# EAGLE design PortalsDualExpVCA (EAGLE 9.6.2)
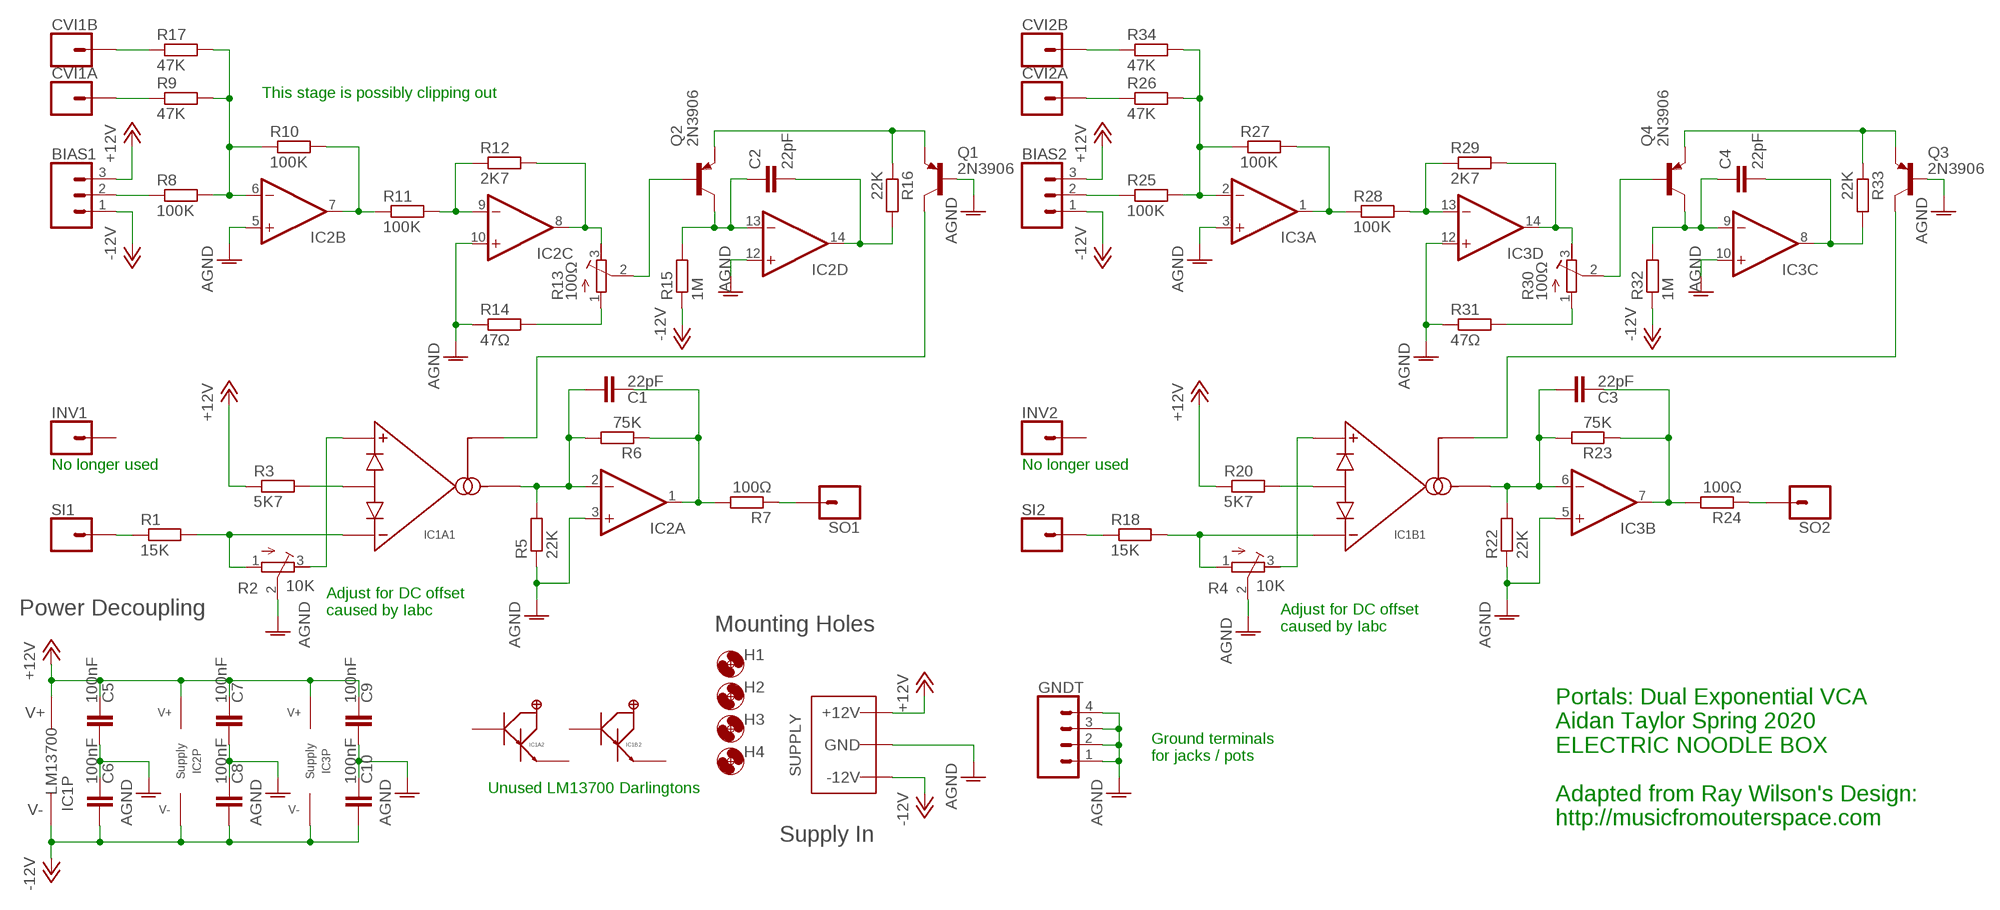
[diagram p0: schematic, sheet 1]

## Parts
BIAS1  3XWIREPAD  [1X03]
BIAS2  3XWIREPAD  [1X03]
C1  22pF  C-EU050-025X075  [C050-025X075]
C2  22pF  C-EU050-025X075  [C050-025X075]
C3  22pF  C-EU050-025X075  [C050-025X075]
C4  22pF  C-EU050-025X075  [C050-025X075]
C5  100nF  C-EU050-025X075  [C050-025X075]
C6  100nF  C-EU050-025X075  [C050-025X075]
C7  100nF  C-EU050-025X075  [C050-025X075]
C8  100nF  C-EU050-025X075  [C050-025X075]
C9  100nF  C-EU050-025X075  [C050-025X075]
C10  100nF  C-EU050-025X075  [C050-025X075]
CVI1A  1XWIREPAD  [1X01]
CVI1B  1XWIREPAD  [1X01]
CVI2A  1XWIREPAD  [1X01]
CVI2B  1XWIREPAD  [1X01]
GNDT  4XWIREPAD  [1X04]
H1  MOUNT-HOLE3.2  [3,2]
H2  MOUNT-HOLE3.2  [3,2]
H3  MOUNT-HOLE3.2  [3,2]
H4  MOUNT-HOLE3.2  [3,2]
IC1  LM13700DIL  [DIL16]
IC2  TL0X4DIL  [DIL14]
IC3  TL0X4DIL  [DIL14]
INV1  1XWIREPAD  [1X01]
INV2  1XWIREPAD  [1X01]
Q1  2N3906  [TO92]
Q2  2N3906  [TO92]
Q3  2N3906  [TO92]
Q4  2N3906  [TO92]
R1  15K  R-EU_0207/10  [0207/10]
R2  10K  R-TRIMM3296W  [RTRIM3296W]
R3  5K7  R-EU_0207/10  [0207/10]
R4  10K  R-TRIMM3296W  [RTRIM3296W]
R5  22K  R-EU_0207/10  [0207/10]
R6  75K  R-EU_0207/10  [0207/10]
R7  100Ω  R-EU_0207/10  [0207/10]
R8  100K  R-EU_0207/10  [0207/10]
R9  47K  R-EU_0207/10  [0207/10]
R10  100K  R-EU_0207/10  [0207/10]
R11  100K  R-EU_0207/10  [0207/10]
R12  2K7  R-EU_0207/10  [0207/10]
R13  100Ω  R-TRIMM3296W  [RTRIM3296W]
R14  47Ω  R-EU_0207/10  [0207/10]
R15  1M  R-EU_0207/10  [0207/10]
R16  22K  R-EU_0207/10  [0207/10]
R17  47K  R-EU_0207/10  [0207/10]
R18  15K  R-EU_0207/10  [0207/10]
R20  5K7  R-EU_0207/10  [0207/10]
R22  22K  R-EU_0207/10  [0207/10]
R23  75K  R-EU_0207/10  [0207/10]
R24  100Ω  R-EU_0207/10  [0207/10]
R25  100K  R-EU_0207/10  [0207/10]
R26  47K  R-EU_0207/10  [0207/10]
R27  100K  R-EU_0207/10  [0207/10]
R28  100K  R-EU_0207/10  [0207/10]
R29  2K7  R-EU_0207/10  [0207/10]
R30  100Ω  R-TRIMM3296W  [RTRIM3296W]
R31  47Ω  R-EU_0207/10  [0207/10]
R32  1M  R-EU_0207/10  [0207/10]
R33  22K  R-EU_0207/10  [0207/10]
R34  47K  R-EU_0207/10  [0207/10]
SI1  1XWIREPAD  [1X01]
SI2  1XWIREPAD  [1X01]
SO1  1XWIREPAD  [1X01]
SO2  1XWIREPAD  [1X01]
WP1  COMBO_SUPPLY_HEADER  [COMBINED_POWER]

## Nets
+12V: BIAS1.3 BIAS2.3 C5.2 C7.2 C9.2 IC1.11(P:V+) IC2.4(P:V+) IC3.4(P:V+) R3.1 R20.1 WP1.V+1(V++) WP1.V+2(V++) WP1.V+3(V++)
-12V: BIAS1.1 BIAS2.1 C6.1 C8.1 C10.1 IC1.6(P:V-) IC2.11(P:V-) IC3.11(P:V-) R15.1 R32.1 WP1.V-1(V--) WP1.V-2(V--) WP1.V-3(V--)
AGND: C5.1 C6.2 C7.1 C8.2 C9.1 C10.2 GNDT.1 GNDT.2 GNDT.3 GNDT.4 IC2.3(A:+IN) IC2.5(B:+IN) IC2.10(C:+IN) IC2.12(D:+IN) IC3.3(A:+IN) IC3.5(B:+IN) IC3.10(C:+IN) IC3.12(D:+IN) Q1.2(B) Q3.2(B) R2.2(S) R4.2(S) R5.1 R14.1 R22.1 R31.1 WP1.GND1(AGND) WP1.GND2(AGND) WP1.GND3(AGND) WP1.GND4(AGND) WP1.GND5(AGND) WP1.GND6(AGND) WP1.GND7(AGND) WP1.GND8(AGND)
N$1: R1.1 SI1.1
N$2: IC1.3(A1:AMP+) R2.3(E)
N$3: BIAS1.2 R8.1
N$4: IC1.4(A1:AMP-) R1.2 R2.1(A)
N$5: IC1.2(A1:DIODES) R3.2
N$6: R7.1 SO1.1
N$7: C1.1 IC1.5(A1:AMPOUT) IC2.2(A:-IN) R5.2 R6.2
N$8: C1.2 IC2.1(A:OUT) R6.1 R7.2
N$9: CVI1A.1 R9.1
N$10: IC2.6(B:-IN) R8.2 R9.2 R10.1 R17.2
N$11: IC2.7(B:OUT) R10.2 R11.1
N$12: IC2.9(C:-IN) R11.2 R12.1
N$13: IC2.8(C:OUT) R12.2 R13.3(E)
N$14: R13.1(A) R14.2
N$15: Q2.2(B) R13.2(S)
N$16: C2.1 IC2.13(D:-IN) Q2.1(C) R15.2
N$17: Q1.3(E) Q2.3(E) R16.1
N$18: C2.2 IC2.14(D:OUT) R16.2
N$19: CVI1B.1 R17.1
N$20: IC1.1(A1:AMPBIAS) Q1.1(C)
N$21: R18.1 SI2.1
N$22: IC1.14(B1:AMP+) R4.3(E)
N$23: IC1.13(B1:AMP-) R4.1(A) R18.2
N$24: IC1.15(B1:DIODES) R20.2
N$25: C3.1 IC1.12(B1:AMPOUT) IC3.6(B:-IN) R22.2 R23.2
N$26: C3.2 IC3.7(B:OUT) R23.1 R24.2
N$27: R24.1 SO2.1
N$28: BIAS2.2 R25.1
N$29: CVI2A.1 R26.1
N$30: IC3.2(A:-IN) R25.2 R26.2 R27.1 R34.2
N$31: IC3.1(A:OUT) R27.2 R28.1
N$32: IC3.13(D:-IN) R28.2 R29.1
N$33: IC3.14(D:OUT) R29.2 R30.3(E)
N$34: R30.1(A) R31.2
N$35: C4.1 IC3.9(C:-IN) Q4.1(C) R32.2
N$36: C4.2 IC3.8(C:OUT) R33.2
N$37: Q3.3(E) Q4.3(E) R33.1
N$38: IC1.16(B1:AMPBIAS) Q3.1(C)
N$39: Q4.2(B) R30.2(S)
N$40: CVI2B.1 R34.1
Unconnected: IC1.7(A2:BUFF_IN) IC1.8(A2:BUFF_OUT) IC1.9(B2:BUFF_OUT) IC1.10(B2:BUFF_IN) INV1.1 INV2.1

## Notes on the sheet
- This stage is possibly clipping out
- No longer used | No longer used
- Power Decoupling
- Adjust for DC offset
  caused by Iabc
- Mounting Holes
- Adjust for DC offset
  caused by Iabc
- Ground terminals
  for jacks / pots
- Unused LM13700 Darlingtons
- Portals: Dual Exponential VCA
  Aidan Taylor Spring 2020
  ELECTRIC NOODLE BOX
  
  Adapted from Ray Wilson's Design:
  http://musicfromouterspace.com
- Supply In

## Library data of the parts
BIAS1 BIAS2 = ElectricNoodleBox:3XWIREPAD
C1-C10 = rcl:C-EU: CAPACITOR, European symbol; SPICEPREFIX: C
CVI1A CVI1B CVI2A CVI2B INV1 INV2 SI1 SI2 SO1 SO2 = ElectricNoodleBox:1XWIREPAD
GNDT = ElectricNoodleBox:4XWIREPAD
H1-H4 = holes:MOUNT-HOLE: MOUNTING HOLE with drill center marker
IC1 = ElectricNoodleBox:LM13700
IC2 IC3 = ElectricNoodleBox:TL0X4
Q1-Q4 = transistor-pnp:2N3906: PNP Transistor
R1 R3 R5-R12 R14-R18 R20 R22-R29 R31-R34 = rcl:R-EU_: RESISTOR, European symbol; SPICEPREFIX: R
R2 R4 R13 R30 = rcl:R-TRIMM: Trimm resistor; SPICEMODEL: X; SPICEPREFIXL: POT
WP1 = ElectricNoodleBox:COMBO_SUPPLY_HEADER

## Board
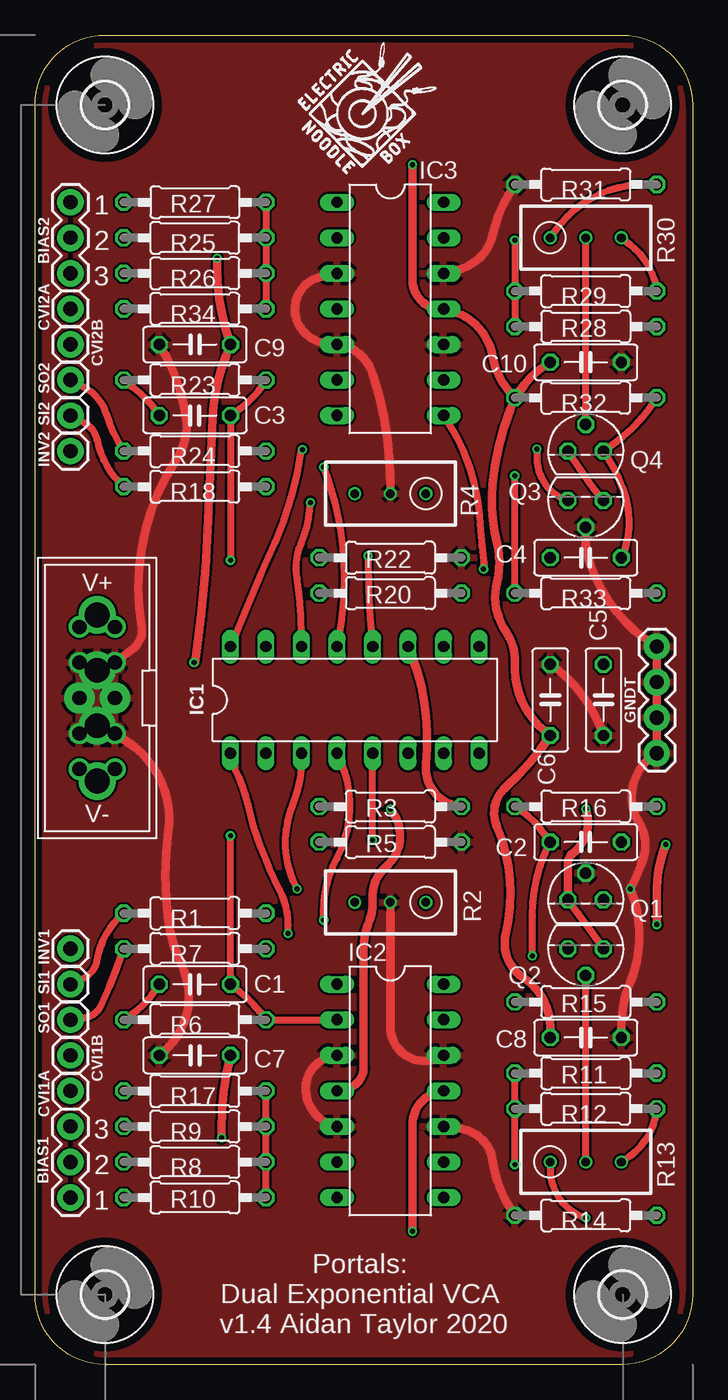
[diagram p1: board, top side]
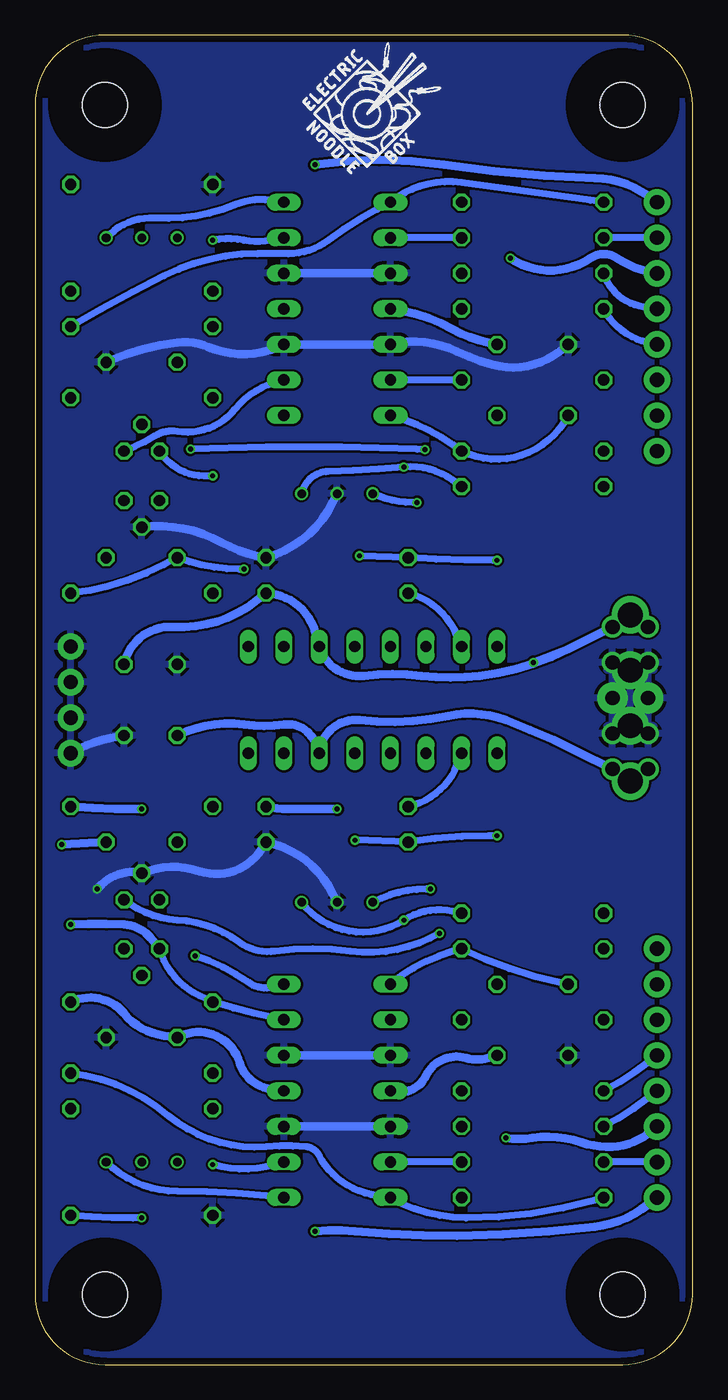
[diagram p2: board, bottom side, seen from below]

Size 47 x 95 mm. Coordinates in mm from the lower left corner, seen from the top.
Outline: 47,90 47,5 arc-90 42,0 5,0 arc-90 0,5 0,90 arc-90 5,95 42,95 arc-90 47,90
Copper layers (1*16): Top 0.035mm / dielectric 1.6mm / Bottom 0.035mm
Design rules "Elecrow_2-layer_PCB_eagle_rule": minimum track width 6mil, minimum drill 12mil, track to track 6mil, track to pad 6mil, pad to pad 6mil, via to via 8mil, smd to smd 0mil, copper to edge 20mil, drill to drill 10mil, minimum pad ring 6mil, minimum via ring 6mil, stop-mask expansion 0mil, vias tented up to drill 100mil, thermal gap 10mil

### Footprints (pad centres in the part's own frame; a part is rotated, then mirrored left to right if it is on the bottom)
1X03 = drill 1.016 pad 1.88: 1 0,0; 2 2.54,0; 3 5.08,0
C050-025X075 = drill 0.813 octagon: 1 -2.54,0; 2 2.54,0
1X01 = drill 1.016 pad 1.88: 1 0,0
1X04 = drill 1.016 pad 1.88: 1 0,0; 2 2.54,0; 3 5.08,0; 4 7.62,0
3,2 = hole 3.2: 0,0
DIL16 = drill 0.813 long: 1 -8.89,-3.81; 2 -6.35,-3.81; 3 -3.81,-3.81; 4 -1.27,-3.81; 5 1.27,-3.81; 6 3.81,-3.81; 7 6.35,-3.81; 8 8.89,-3.81; 9 8.89,3.81; 10 6.35,3.81; 11 3.81,3.81; 12 1.27,3.81; 13 -1.27,3.81; 14 -3.81,3.81; 15 -6.35,3.81; 16 -8.89,3.81
DIL14 = drill 0.813 long: 1 -7.62,-3.81; 2 -5.08,-3.81; 3 -2.54,-3.81; 4 0,-3.81; 5 2.54,-3.81; 6 5.08,-3.81; 7 7.62,-3.81; 8 7.62,3.81; 9 5.08,3.81; 10 2.54,3.81; 11 0,3.81; 12 -2.54,3.81; 13 -5.08,3.81; 14 -7.62,3.81
TO92 = drill 0.813 octagon: 1 1.27,0; 2 0,1.905; 3 -1.27,0
0207/10 = drill 0.813 octagon: 1 -5.08,0; 2 5.08,0
RTRIM3296W = drill 0.61: 1 0,-2.54; 2 0,0; 3 0,2.54
COMBINED_POWER = drill 1.78: GND1 -1.98,0; GND2 1.98,0; V+1 -5.94,0; V-1 5.94,0 | drill 1.016: GND3 -2.54,1.27; GND5 2.54,1.27; GND6 -2.54,-1.27; GND8 2.54,-1.27; V+2 -5.08,1.27; V+3 -5.08,-1.27; V-2 5.08,1.27; V-3 5.08,-1.27 | drill 1.016 pad 2.184: GND4 0,1.27; GND7 0,-1.27

### Placement (x,y rotation side)
BIAS1  2.54,11.93 90 top
BIAS2  2.54,83.05 270 top
C1  11.43,27.17 180 top
C2  39.37,37.33 180 top
C3  11.43,67.81 180 top
C4  39.37,57.65 180 top
C5  40.64,47.49 90 top
C6  36.83,47.49 90 top
C7  11.43,22.09 0 top
C8  39.37,23.36 0 top
C9  11.43,72.89 0 top
C10  39.37,71.62 0 top
CVI1A  2.54,19.55 0 top
CVI1B  2.54,22.09 0 top
CVI2A  2.54,75.43 0 top
CVI2B  2.54,72.89 0 top
GNDT  44.45,43.68 90 top
H1  42,5 0 top
H2  5,5 0 top
H3  42,90 0 top
H4  5,90 0 top
IC1  22.86,47.49 0 top
IC2  25.4,19.55 270 top
IC3  25.4,75.43 270 top
INV1  2.54,29.71 0 top
INV2  2.54,65.27 0 top
Q1  39.37,33.2 0 top
Q2  39.37,29.71 180 top
Q3  39.37,61.73 180 top
Q4  39.37,65.27 0 top
R1  11.43,32.25 0 top
R2  25.4,33.02 90 top
R3  25.4,39.87 180 top
R4  25.4,62.23 90 top
R5  25.4,37.33 180 top
R6  11.43,24.63 0 top
R7  11.43,29.71 0 top
R8  11.43,14.47 0 top
R9  11.43,17.01 0 top
R10  11.43,11.93 180 top
R11  39.37,20.82 180 top
R12  39.37,18.28 0 top
R13  39.37,14.47 270 top
R14  39.37,10.66 0 top
R15  39.37,25.9 180 top
R16  39.37,39.87 180 top
R17  11.43,19.55 0 top
R18  11.43,62.73 0 top
R20  25.4,55.11 180 top
R22  25.4,57.65 180 top
R23  11.43,70.35 0 top
R24  11.43,65.27 0 top
R25  11.43,80.51 0 top
R26  11.43,77.97 0 top
R27  11.43,83.05 180 top
R28  39.37,74.16 180 top
R29  39.37,76.7 0 top
R30  39.37,80.51 270 top
R31  39.37,84.32 0 top
R32  39.37,69.08 0 top
R33  39.37,55.11 0 top
R34  11.43,75.43 0 top
SI1  2.54,27.17 0 top
SI2  2.54,67.81 0 top
SO1  2.54,24.63 0 top
SO2  2.54,70.35 0 top
U$1  [LOGO10X10]  18.73,84.77 0 top
U$2  [LOGO10X10]  27.94,84.77 0 bottom
WP1  4.45,47.62 270 top

### Tracks (layer width: path | path; a pad name or v marks a point on that pad's centre or on a via)
+12V  (via drill 0.35)
  Top 0.61: v13.34,16.19 13.34,16.83 arc-14 C7.2 | v13.02,79.06 13.02,78.42 arc20 C9.2 13.65,72.07 arc18 12.7,67.63 arc1 12.38,60.33 arc-7 11.43,50.16 arc-173 v11.36,50.17 | IC1.11 26.99,50.48 arc-16 27.94,46.35 arc-10 27.94,42.86 arc90 R3.1 | IC2.4 22.23,19.68 arc79 23.5,21.27 arc-1 23.5,29.84 arc-21 23.81,31.43 arc25 24.13,33.34 arc-52 25.08,35.56 arc90 v25.4,39.69 | WP1.V+3 WP1.V+1
  Bottom 0.61: BIAS1.3 3.17,16.51 arc35 5.71,15.56 arc22 7.94,15.88 arc-28 11.43,16.19 arc18 v13.34,16.19 | WP1.V+1 5.2,53.05 WP1.V+2 8.89,51.12 | 8.89,51.12 arc20 15.24,49.21 arc14 19.37,49.21 arc-14 23.5,49.21 arc80 IC1.11 26.99,52.39 arc-72 R20.1 31.11,54.61 arc41 37.15,52.7 arc-81 C5.2 | BIAS2.3 3.17,78.11 arc22 5.4,79.06 arc-69 7.3,79.06 arc69 v13.02,79.06 | C7.2 14.61,21.91 arc32 16.19,21.91 arc-80 19.05,20.64 arc82 IC2.4 | C9.2 14.61,73.03 arc17 17.14,73.98 arc-22 IC3.4 | v11.36,50.17 8.89,51.12 | v25.4,39.69 28.89,39.69 arc13 R3.1
-12V  (via drill 0.35)
  Top 0.61: IC2.11 arc85 26.99,17.14 v26.99,9.53 | v26.99,85.72 26.99,77.47 arc95 IC3.11 29.84,75.25 arc-64 32.7,72.07 arc36 R32.1 | C8.1 36.83,24.13 arc57 34.92,27.62 arc-71 33.66,30.8 arc37 33.02,38.42 arc-71 33.66,41.27 arc15 C6.1 arc-57 34.29,50.16 arc37 33.66,52.39 arc-49 33.02,55.88 arc28 33.02,58.74 arc-19 32.7,62.87 arc-16 33.97,68.26 R32.1 | R32.1 34.61,69.53 arc-23 C10.1 | WP1.V-3 WP1.V-1
  Bottom 0.61: BIAS1.1 3.17,11.43 arc31 6.99,9.84 arc7 16.83,9.21 arc6 24.13,9.53 arc-11 v26.99,9.53 | WP1.V-1 5.08,41.91 arc51 WP1.V-2 8.26,43.81 arc-6 13.34,46.04 arc-33 17.46,46.35 arc18 23.81,46.04 arc-91 IC1.6 26.99,44.45 arc-76 29.21,45.72 arc16 32.07,45.72 arc-35 C6.1 | BIAS2.1 3.17,83.5 arc-34 6.99,84.77 arc7 17.78,85.72 arc-17 v26.99,85.72 | IC2.11 30.16,19.68 arc65 32.38,21.59 arc-103 C8.1 37.78,23.5 arc42 40.64,25.08 arc-76 R15.1
AGND  (via drill 0.35)
  Top 0.61: WP1.GND1 WP1.GND3 6.99,51.12 arc63 7.62,52.7 arc-43 10.16,64.77 arc42 10.79,67.63 arc23 C9.1 | WP1.GND2 WP1.GND5 6.67,44.45 arc-64 9.53,38.1 arc16 9.53,31.75 arc18 10.48,28.57 arc-79 C7.1 | IC3.3 arc-31 20.95,77.79 arc171 20.64,73.03 IC3.5 arc-65 24.13,70.8 arc-18 25.4,62.87 R4.2 | IC2.12 arc-124 25.4,24.13 R2.2 | IC2.3 20.95,21.91 arc68 19.37,20 arc84 IC2.5 | IC2.10 30.48,16.83 arc-74 32.7,14.61 arc27 R14.1 | C8.2 41.91,24.13 arc-23 42.55,27.3 arc45 v42.55,33.97 42.86,34.61 arc10 43.5,36.2 arc48 43.18,38.73 arc-91 GNDT.1 GNDT.2 GNDT.3 GNDT.4 arc-40 39.69,57.15 arc-19 39.37,59.05 Q3.2 | C5.1 40.32,45.72 arc33 C6.2 | IC3.12 29.84,78.11 arc29 31.75,79.06 arc36 32.7,80.64 arc-21 R31.1 | WP1.GND1 WP1.GND4 WP1.GND2 | WP1.GND2 4.32,45.84 | 4.32,45.84 WP1.GND7 WP1.GND1 | WP1.GND1 WP1.GND6 | WP1.GND8 4.32,45.84
  Bottom 0.61: C9.1 9.53,72.39 arc54 14.29,71.44 arc10 16.83,72.39 arc-39 IC3.5 IC3.10 arc50 34.61,72.71 arc-30 36.83,73.03 arc-16 41.59,71.75 C10.2 | R4.2 25.72,61.59 arc48 R22.1 31.11,57.78 arc17 33.66,58.74 arc-37 Q3.2 | IC3.3 IC3.12 | R2.2 25.72,33.66 arc-52 R5.1 30.8,36.83 arc76 35.24,35.24 arc-40 Q1.2 arc-58 42.23,34.29 v42.55,33.97 | IC2.12 IC2.3 | IC2.5 IC2.10 | C5.1 41.59,44.77 arc-20 GNDT.1
  pour Top: 0,0 47,0 47,95 0,95
  pour Bottom: 0,0 47,0 47,95 0,95
N$1
  Top 0.508: SI1.1 3.49,27.62 arc55 4.45,28.89 arc-41 R1.1
N$2  (via drill 0.35)
  Top 0.508: IC1.3 19.05,43.18 arc-23 18.41,40.01 arc51 v18.73,33.97
  Bottom 0.508: v18.73,33.97 19.05,33.97 arc-28 R2.3
N$3
  Bottom 0.508: BIAS1.2 R8.1
N$4  (via drill 0.35)
  Top 0.508: v20.64,31.75 20.64,32.38 arc-28 21.59,36.2 arc56 IC1.4
  Bottom 0.508: R1.2 17.14,32.38 arc-45 v20.64,31.75 arc85 R2.1
N$5
  Bottom 0.508: IC1.2 16.83,42.86 arc56 R3.2
N$6
  Top 0.508: SO1.1 3.49,24.77 arc58 4.76,25.72 arc5 R7.1
N$7  (via drill 0.35)
  Top 0.508: IC2.2 R6.2 arc17 14.61,26.67 C1.1 v13.97,37.78 | v24.13,37.47 IC1.5
  Bottom 0.508: v13.97,37.78 14.61,37.78 arc-9 R5.2 v24.13,37.47
N$8
  Top 0.508: R6.1 6.99,25.08 arc24 C1.2
  Bottom 0.508: C1.2 9.53,27.3 arc14 R7.2 17.14,29.53 arc-24 IC2.1
N$9
  Bottom 0.508: CVI1A.1 3.17,19.05 arc11 R9.1
N$10
  Top 0.508: R10.1 R8.2 R9.2 R17.2
  Bottom 0.508: R8.2 IC2.6
N$11
  Bottom 0.508: R10.2 6.99,11.75 arc16 16.19,10.48 arc29 IC2.7 22.54,12.06 arc32 25.4,13.34 arc23 26.67,14.92 arc-58 27.62,15.56 arc-9 30.48,15.56 arc44 37.47,17.78 arc-33 R11.1
N$12  (via drill 0.35)
  Top 0.508: v34.29,14.29 R12.1 R11.2
  Bottom 0.508: IC2.9 29.84,14.29 arc32 v34.29,14.29
N$13
  Top 0.508: R13.3 42.55,14.92 arc50 R12.2
  Bottom 0.508: IC2.8 30.48,12.06 arc-6 36.83,12.38 arc45 R13.3
N$14  (via drill 0.35)
  Top 0.508: R13.1 36.83,13.97 arc72 v39.37,10.48
  Bottom 0.508: v39.37,10.48 40.01,10.48 arc5 R14.2
N$15
  Top 0.508: R13.2 Q2.2
N$16  (via drill 0.35)
  Top 0.61: v45.09,37.15 arc23 44.45,33.97 v44.45,31.43
  Bottom 0.508: IC2.13 29.84,24.77 arc5 R15.2 35.24,26.35 arc48 Q2.1
  Bottom 0.61: Q2.1 38.73,30.48 arc-48 40.64,31.43 arc-5 v44.45,31.43 | v45.09,37.15 C2.1
N$17  (via drill 0.35)
  Top 0.508: Q2.3 40.32,30.16 arc2 Q1.3
  Top 0.61: v39.37,39.69 arc-73 38.42,36.51 arc53 38.1,35.88 Q1.3
  Bottom 0.61: v39.37,39.69 39.69,39.69 arc4 R16.1
N$18  (via drill 0.35)
  Top 0.508: R16.2 arc-23 36.51,37.78 C2.2 arc27 35.56,32.07 v35.56,29.21
  Bottom 0.508: IC2.14 29.84,26.99 arc51 31.75,27.3 arc-17 v35.56,29.21
N$19
  Bottom 0.508: CVI1B.1 3.17,21.59 arc11 R17.1
N$20  (via drill 0.35)
  Top 0.508: IC1.1 14.29,42.55 arc-16 15.24,40.01 arc16 17.46,33.97 arc-28 18.1,31.43 v18.1,30.8
  Bottom 0.508: v18.1,30.8 18.73,30.48 arc34 24.45,29.53 arc-15 29.84,29.53 arc43 32.38,30.16 arc-32 36.83,31.75 arc35 Q1.1
N$21
  Top 0.508: SI2.1 3.49,67.31 arc-51 4.45,66.04 arc37 R18.1
N$22  (via drill 0.35)
  Top 0.508: IC1.14 19.05,52.07 arc9 18.73,56.2 arc-32 19.05,58.74 arc21 v19.68,61.59
  Bottom 0.508: v19.68,61.59 20,61.59 arc25 R4.3
N$23  (via drill 0.35)
  Top 0.508: v20.64,64.14 20.95,63.18 arc-31 IC1.13
  Bottom 0.508: R18.2 17.14,63.18 arc-40 v20.64,64.14 arc3 26.04,63.82 arc-76 R4.1
N$24
  Bottom 0.508: IC1.15 16.83,52.07 arc-53 R20.2
N$25  (via drill 0.35)
  Top 0.508: R23.2 arc-24 14.61,68.26 C3.1 v13.97,57.47 | v23.81,57.78 23.81,57.47 arc6 IC1.12
  Bottom 0.508: R23.2 IC3.6 | v13.97,57.47 14.29,57.47 arc3 R22.2 v23.81,57.78
N$26
  Top 0.508: R23.1 6.99,69.85 arc-17 C3.2
  Bottom 0.508: C3.2 9.21,67.31 arc84 R24.2 17.14,65.72 arc-21 IC3.7
N$27
  Top 0.508: SO2.1 3.49,69.85 arc-45 5.08,67.94 arc16 R24.1
N$28
  Bottom 0.508: BIAS2.2 R25.1
N$29
  Bottom 0.508: CVI2A.1 3.49,75.56 arc64 R26.1
N$30
  Top 0.508: R27.1 R25.2 R26.2 R34.2
  Bottom 0.508: R25.2 IC3.2
N$31
  Bottom 0.508: R27.2 7.3,83.19 16.51,84.45 arc-47 IC3.1 22.54,82.55 arc-10 26.04,80.33 arc38 28.89,79.38 arc-1 31.11,79.38 arc-26 37.78,77.79 arc-4 R28.1
N$32  (via drill 0.35)
  Top 0.508: R28.2 R29.1 v34.29,80.33
  Bottom 0.508: IC3.13 30.16,80.33 arc22 32.07,80.33 arc-22 v34.29,80.33
N$33
  Top 0.508: R30.3 42.55,80.01 arc-44 R29.2
  Bottom 0.508: IC3.14 30.16,83.19 arc-30 32.7,82.87 arc26 38.42,81.92 arc-51 R30.3
N$34
  Top 0.508: R30.1 37.15,80.96 arc-61 R31.2
N$35
  Top 0.508: C4.1 arc40 42.23,61.91 arc17 40.96,64.77 40.67,65.22 Q4.1 41.27,65.72 arc22 R32.2
  Bottom 0.508: IC3.9 29.84,70.17 arc-35 32.7,68.26 arc61 36.83,66.67 arc-41 38.42,66.36 arc12 Q4.1
N$36  (via drill 0.35)
  Top 0.508: IC3.8 29.53,67.31 arc-28 31.75,60.64 arc3 32.07,57.47 arc-14 v32.07,56.83
  Bottom 0.508: R33.2 arc-21 37.78,57.15 C4.2 arc-21 32.38,56.83 v32.07,56.83
N$37  (via drill 0.35)
  Top 0.508: R33.1 v34.29,63.5 | Q4.3 38.42,64.77 arc8 Q3.3
  Bottom 0.508: v34.29,63.5 34.92,63.5 arc58 Q4.3
N$38  (via drill 0.35)
  Top 0.508: IC1.16 14.29,52.07 arc-2 17.14,58.74 arc16 19.05,65.41 arc-196 v19.13,65.38 | v35.88,65.41 35.88,64.77 arc72 Q3.1
  Bottom 0.508: v19.13,65.38 19.68,65.41 arc-5 v35.88,65.41
N$39
  Top 0.508: Q4.2 R30.2
N$40
  Bottom 0.508: CVI2B.1 3.17,73.03 arc50 R34.1

### Text on the board
tPlace: 1 | 2 | 3 | 3 | 2 | 1 | Portals: / Dual Exponential VCA / v1.4 Aidan Taylor 2020